# Altium schematic sheet Control.SchDoc: Control
size A; ApprovedBy: Emmanuel Plascencia; CheckedBy: Emmanuel Plascencia; DocumentNumber: 2; SheetNumber: 3; SheetTotal: 3; Size: A
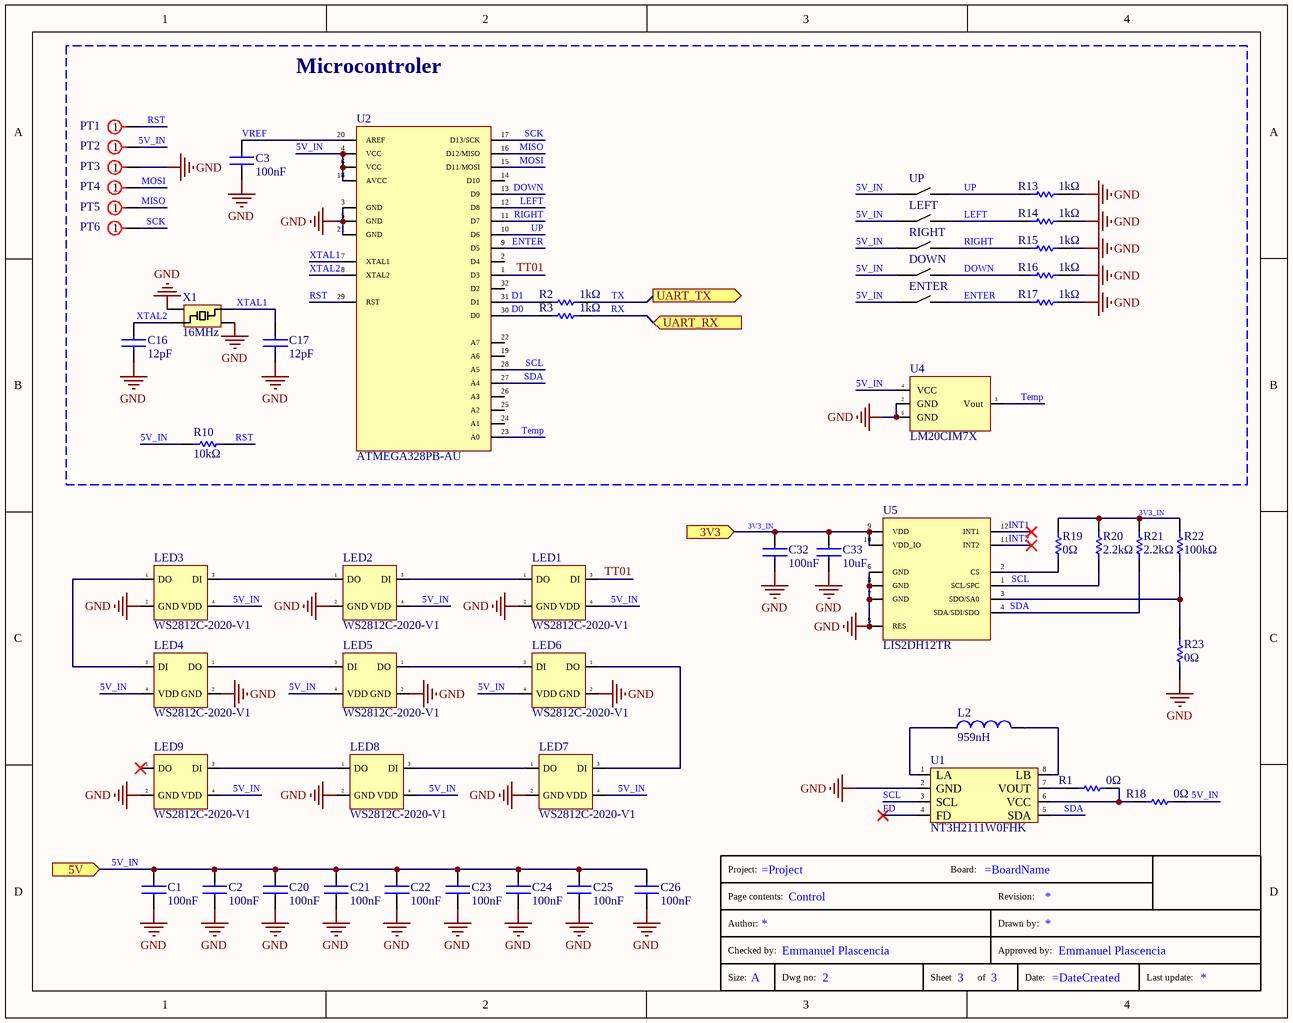
[diagram p0: Control.SchDoc]

## Parts
C1  100nF  [CAP0201_0.65_0.35]
C2  100nF  [CAP0201_0.65_0.35]
C3  100nF  [CAP0201_0.65_0.35]
C16  12pF  [CAP0402]
C17  12pF  [CAP0402]
C20  100nF  [CAP0201_0.65_0.35]
C21  100nF  [CAP0201_0.65_0.35]
C22  100nF  [CAP0201_0.65_0.35]
C23  100nF  [CAP0201_0.65_0.35]
C24  100nF  [CAP0201_0.65_0.35]
C25  100nF  [CAP0201_0.65_0.35]
C26  100nF  [CAP0201_0.65_0.35]
C32  100nF  [CAP0201_0.65_0.35]
C33  10uF  [CAP0402]
DOWN  TS3735PA 300gf 030  [TS3735PA 300gf 030]  (value not drawn)
ENTER  TS3735PA 300gf 030  [TS3735PA 300gf 030]  (value not drawn)
L2  959nH  [Antenne]
LED1  WS2812C-2020-V1  [WS2812C-2020]
LED2  WS2812C-2020-V1  [WS2812C-2020]
LED3  WS2812C-2020-V1  [WS2812C-2020]
LED4  WS2812C-2020-V1  [WS2812C-2020]
LED5  WS2812C-2020-V1  [WS2812C-2020]
LED6  WS2812C-2020-V1  [WS2812C-2020]
LED7  WS2812C-2020-V1  [WS2812C-2020]
LED8  WS2812C-2020-V1  [WS2812C-2020]
LED9  WS2812C-2020-V1  [WS2812C-2020]
LEFT  TS3735PA 300gf 030  [TS3735PA 300gf 030]  (value not drawn)
PT1  1x Test_point_for_beds_of_nails  [POINT-TEST (Pad 1mm no hole)]  (value not drawn)  (no BOM)
PT2  1x Test_point_for_beds_of_nails  [POINT-TEST (Pad 1mm no hole)]  (value not drawn)  (no BOM)
PT3  1x Test_point_for_beds_of_nails  [POINT-TEST (Pad 1mm no hole)]  (value not drawn)  (no BOM)
PT4  1x Test_point_for_beds_of_nails  [POINT-TEST (Pad 1mm no hole)]  (value not drawn)  (no BOM)
PT5  1x Test_point_for_beds_of_nails  [POINT-TEST (Pad 1mm no hole)]  (value not drawn)  (no BOM)
PT6  1x Test_point_for_beds_of_nails  [POINT-TEST (Pad 1mm no hole)]  (value not drawn)  (no BOM)
R1  0Ω  [RES0402]
R2  1kΩ  [RES0402]
R3  1kΩ  [RES0402]
R10  10kΩ  [RES0402]
R13  1kΩ  [RES0402]
R14  1kΩ  [RES0402]
R15  1kΩ  [RES0402]
R16  1kΩ  [RES0402]
R17  1kΩ  [RES0402]
R18  0Ω  [RES0402]
R19  0Ω  [RES0402]
R20  2.2kΩ  [RES0402]
R21  2.2kΩ  [RES0402]
R22  100kΩ  [RES0402]
R23  0Ω  [RES0402]
RIGHT  TS3735PA 300gf 030  [TS3735PA 300gf 030]  (value not drawn)
U1  NT3H2111W0FHK  [QFN8P50_160X160X50L40X20N]
U2  ATMEGA328PB-AU  [TQFP80P900X900X120-32N]
U4  LM20CIM7X  [SOT65P210X110-5N]
U5  LIS2DH12TR  [SON50P200X100-8N]
U?  Title Block  (value not drawn)  (graphical)
UP  TS3735PA 300gf 030  [TS3735PA 300gf 030]  (value not drawn)
X1  16MHz  [CRYSTAL_3.2mmX2.5mm_2]

## Blocks framed on the sheet
Microcontroler: C3 C16 C17 DOWN ENTER LEFT PT1-PT6 R2 R3 R10 R13-R17 RIGHT U2 U4 UP X1

## Ports
3V3 (in), 5V (in), UART_RX (in), UART_TX (out)

## Nets
GND: C1.2 C2.2 C3.2 C16.2 C17.2 C20.2 C21.2 C22.2 C23.2 C24.2 C25.2 C26.2 C32.2 C33.2 LED1.2(GND) LED2.2(GND) LED3.2(GND) LED4.2(GND) LED5.2(GND) LED6.2(GND) LED7.2(GND) LED8.2(GND) LED9.2(GND) PT3.1 R13.1 R14.1 R15.1 R16.1 R17.1 R23.1 U1.2(GND) U2.3(GND) U2.5(GND) U2.21(GND) U4.2(GND) U4.5(GND) U5.5(RES) U5.6(GND) U5.7(GND) U5.8(GND) X1.2 X1.4
3V3_IN: C32.1 C33.1 R19.1 R20.1 R21.1 R22.1 U5.9(VDD) U5.10(VDD_IO) ; port 3V3
5V_IN: C1.1 C2.1 C20.1 C21.1 C22.1 C23.1 C24.1 C25.1 C26.1 DOWN.1(A1) ENTER.1(A1) LED1.4(VDD) LED2.4(VDD) LED3.4(VDD) LED4.4(VDD) LED5.4(VDD) LED6.4(VDD) LED7.4(VDD) LED8.4(VDD) LED9.4(VDD) LEFT.1(A1) PT2.1 R10.1 R18.2 RIGHT.1(A1) U2.4(VCC) U2.6(VCC) U2.18(AVCC) U4.4(VCC) UP.1(A1) ; port 5V
D0: R3.1 U2.30(D0)
D1: R2.1 U2.31(D1)
DOWN: DOWN.2(A2) R16.2 U2.13(D9)
ENTER: ENTER.2(A2) R17.2 U2.9(D5)
FD: U1.4(FD)
INT1: U5.12(INT1)
INT2: U5.11(INT2)
LEFT: LEFT.2(A2) R14.2 U2.12(D8)
MISO: PT5.1 U2.16(D12/MISO)
MOSI: PT4.1 U2.15(D11/MOSI)
RIGHT: R15.2 RIGHT.2(A2) U2.11(D7)
RST: PT1.1 R10.2 U2.29(RST)
RX: R3.2 ; port UART_RX
SCK: PT6.1 U2.17(D13/SCK)
SCL: R20.2 U1.3(SCL) U2.28(A5) U5.1(SCL/SPC)
SDA: R21.2 U1.5(SDA) U2.27(A4) U5.4(SDA/SDI/SDO)
Temp: U2.23(A0) U4.3(Vout)
TT01: LED1.3(DI) U2.1(D3)
TX: R2.2 ; port UART_TX
UP: R13.2 U2.10(D6) UP.2(A2)
VREF: C3.1 U2.20(AREF)
XTAL1: C17.1 U2.7(XTAL1) X1.3
XTAL2: C16.1 U2.8(XTAL2) X1.1
NetL2_1: L2.1 U1.1(LA)
NetL2_2: L2.2 U1.8(LB)
NetLED1_1: LED1.1(DO) LED2.3(DI)
NetLED2_1: LED2.1(DO) LED3.3(DI)
NetLED3_1: LED3.1(DO) LED4.3(DI)
NetLED4_1: LED4.1(DO) LED5.3(DI)
NetLED5_1: LED5.1(DO) LED6.3(DI)
NetLED6_1: LED6.1(DO) LED7.3(DI)
NetLED7_1: LED7.1(DO) LED8.3(DI)
NetLED8_1: LED8.1(DO) LED9.3(DI)
NetR1_1: R1.1 U1.7(VOUT)
NetR1_2: R1.2 R18.1 U1.6(VCC)
NetR19_2: R19.2 U5.2(CS)
NetR22_2: R22.2 R23.2 U5.3(SDO/SA0)

Not connected (* = marked no-connect by the designer): LED9 1(DO)*; U2 2(D4) 14(D10) 19(A6) 22(A7) 24(A1) 25(A2) 26(A3) 32(D2)

## Notes on the sheet
- (in symbol Title Blok OLEDCOMM) Project:; Board:; Page contents:; Revision:; Author:; Drawn by:; Checked by:; Approved by:; Size:; Dwg no:; Sheet; of; Date:; Last update:

## Library data of the parts
C1-C3 C20-C26 C32 = C0201_100nF_10V_X5R: Capacitor ceramic MLCC - SMD 0201 100nF, 10V, X5R, 10%; Ref Fabricant: GRM033R61A104KE15D; Ref Fournisseur: C76934; Fournisseur: LCSC; Fabricant: Murata Electronics; Unit Price(100): 0.002; Unit Price(10000): 0.0015; Help URL: https://lcsc.com/product-detail/Multilayer-Ceramic-Capacitors-MLCC-SMD-SMT_Murata-Electronics-GRM033R61A104KE15D_C76934.html; Unit Price: 0.002; Unit Price(10): 0.002
C16 C17 = C0402_12pF_50V_C0G (NP0): Capacitor ceramic MLCC - SMD 0402 12pF, 50V, C0G (NP0), 20%; Ref Fabricant: CC0402JRNPO9BN120; Ref Fournisseur: C106201; Fournisseur: LCSC; Fabricant: Yageo; Unit Price(100): 0.0013; Unit Price(1000): 0.001; Unit Price(10000): 0.0009; Unit Price(100000): 0.0008; Help URL: https://www.mouser.fr/ProductDetail/YAGEO/CC0402JRNPO9BN120?qs=%2Fha2pyFadugad28DmURO4f8iWSv%252BQnq1zQRrAWNTY3HHadEPskU8GA%3D%3D; Unit Price: 0.0013; Unit Price(10): 0.0013
C33 = C0402_10uF_10V_X5R: Capacitor ceramic MLCC - SMD 0402 10uF, 10V, X5R, 20%; Ref Fabricant: CL05A106MP5NUNC; Ref Fournisseur: C315248; Fournisseur: LCSC; Fabricant: Samsung Electro-Mechanics; Unit Price(100): 0.011; Unit Price(1000): 0.009; Unit Price(1500): 0.0079; Unit Price(10000): 0.0065; Unit Price(20000): 0.006; Unit Price(50000): 0.0057; Help URL: https://datasheet.lcsc.com/lcsc/2007131004_Samsung-Electro-Mechanics-CL05A106MP5NUNC_C315248.pdf; Unit Price: 0.011; Unit Price(10): 0.011; Unit Price(50): 0.011; Unit Price(500): 0.009
DOWN ENTER LEFT RIGHT UP = TS3735PA 300gf 030: Tactile Switch SPST 300gf Surface Mount; Fournisseur: LCSC; Ref Fournisseur: C5363478; Fabricant: SHOU HAN; Unit Price(50): 0.0188; Unit Price(500): 0.0147; Unit Price(1500): 0.0125; Ref Fabricant: TS3735PA 300gf 030; Help URL: https://www.lcsc.com/datasheet/C5363478.pdf?spm=wm.sxq.inf.ggs___wm.fly.bg.6.xh&lcsc_vid=FgJXV1VSRgJaVwUHEgQNVVQEQlFXBl0FFVhdUwYFRgUxVlNRQVFXUV1QRVlXXjsOAxUeFF5JWBYZEEoKFBINSQcJGk4NBhADEA4cHktQQ1NADxALGw%3D%3D; Unit Price: 0.0188
L2 = Antenne: 959nH 1.6pF 1.36ohm 128MHz
LED1-LED9 = WS2812C-2020-V1: Intelligent external control integrated LED - CMS RGB, 2020; Ref Fournisseur: C2976072; Fournisseur: LCSC; Fabricant: Worldsemi; Unit Price(10): 0.0893; Unit Price(100): 0.0736; Unit Price(1000): 0.0599; Unit Price(150): 0.0658; Unit Price(2500): 0.0484; Unit Price(4500): 0.046; Ref Fabricant: WS2812C-2020-V1; Help URL: https://datasheet.lcsc.com/lcsc/2202221130_Worldsemi-WS2812C-2020-V1_C2976072.pdf; Unit Price: 0.0893; Unit Price(5): 0.0893; Unit Price(50): 0.0736; Unit Price(500): 0.0599
PT1-PT6 = 1x_Test_point_for_beds_of_nails: Fabricant: PCB Footprint; Ref Fabricant: PCB Footprint; Fournisseur: PCB Footprint; Ref Fournisseur: PCB Footprint; Help URL: PCB Footprint
R1 R18 R19 R23 = R0402_0R_50V_Thick: Resistor Thick Film SMD 0402, 0Ω, 50V, 1/16W, 1%; Ref Fabricant: RC0402FR-070RL; Ref Fournisseur: C106231; Fournisseur: LCSC; Fabricant: YAGEO; Unit Price(100): 0.0006; Unit Price(1000): 0.0004; Help URL: https://datasheet.lcsc.com/lcsc/1809291220_YAGEO-RC0402FR-070RL_C106231.pdf; Unit Price: 0.0006; Unit Price(10): 0.0006
R2 R3 R13-R17 = R0402_1k_50V_Thick: Resistor Thick Film SMD 0402, 1kΩ, 50V, 1/16W, 1%; Ref Fabricant: RC0402FR-071KL; Ref Fournisseur: C106235; Fournisseur: LCSC; Fabricant: YAGEO; Unit Price(100): 0.0007; Unit Price(1000): 0.0006; Unit Price(10000): 0.0005; Help URL: https://datasheet.lcsc.com/lcsc/1809301716_YAGEO-RC0402FR-071KL_C106235.pdf; Unit Price: 0.0007; Unit Price(10): 0.0007
R10 = R0402_10k_50V_Thick: Resistor Thick Film SMD 0402, 10kΩ, 50V, 1/16W, 1%; Ref Fabricant: RC0402FR-0710KL; Ref Fournisseur: C60490; Fournisseur: LCSC; Fabricant: YAGEO; Unit Price(100): 0.0007; Unit Price(1000): 0.0005; Unit Price(50000): 0.0004; Help URL: https://datasheet.lcsc.com/lcsc/1809301715_YAGEO-RC0402FR-0710KL_C60490.pdf; Unit Price: 0.0007; Unit Price(10): 0.0007
R20 R21 = R0402_2.2k_50V_Thick: Resistor Thick Film SMD 0402, 2.2kΩ, 50V, 1/16W, 1%; Ref Fabricant: RC0402FR-072K2L; Ref Fournisseur: 603-RC0402FR-072K2L; Fournisseur: Mouser; Fabricant: Yageo; Unit Price(100): 0.003; Unit Price(10): 0.01; Help URL: https://www.mouser.fr/datasheet/2/447/PYu-RC_Group_51_RoHS_L_10-1527934.pdf; Unit Price: 0.087; Unit Price(1000): 0.003
R22 = R0402_100k_50V_Thick_1: Resistor Thick Film SMD 0402, 100kΩ, 50V, 63mW, 1%; Ref Fabricant: AECR0402F100KK9; Ref Fournisseur: C328296; Fournisseur: LCSC; Fabricant: Resistor.Today; Unit Price(100): 0.0022; Unit Price(1000): 0.0018; Unit Price(3000): 0.0015; Unit Price(10000): 0.0012; Unit Price(100000): 0.0011; Help URL: https://datasheet.lcsc.com/lcsc/1811091031_Resistor-Today-AECR0402F100KK9_C328296.pdf; Unit Price: 0.0022; Unit Price(10): 0.0022
U1 = NT3H2111W0FHK: NTAG I²C plus: NFC Forum T2T with I²C interface, password protection and energy harvesting; Fournisseur: LCSC; Ref Fournisseur: C710403; Fabricant: Nexperia; Unit Price(50): 0.634; Unit Price(150): 0.5663; Unit Price(500): 0.4985; Ref Fabricant: NT3H2111W0FHK; Help URL: https://www.lcsc.com/product-detail/C710403.html?s_z=n_NT3H2111W0FHK; Unit Price: 0.7711
U2 = ATMEGA328PB-AU: AVR Microcontroller with Core Independent Peripherals and PicoPower Technology; Fabricant: MICROCHIP; Fournisseur: LCSC; Ref Fournisseur: C132230; Unit Price(10): 1.5496; Unit Price(30): 1.3877; Unit Price(1000): 1.0721; Help URL: https://www.lcsc.com/datasheet/C132230.pdf?spm=wm.sxq.inf.ggs___wm.ssy.bg.0.xh&lcsc_vid=FgJXV1VSRgJaVwUHEgQNVVQEQlFXBl0FFVhdUwYFRgUxVlNRQVFWV1VXQ1hYVjsOAxUeFF5JWBYZEEoKFBINSQcJGk4%3D; Ref Fabricant: ATMEGA328PB-AU; Unit Price: 1.8076
U4 = LM20CIM7X: SC-70-5 Thermostats - Solid State RoHS; Fabricant: Texas Instruments; Fournisseur: LCSC; Ref Fabricant: LM20CIM7X/NOPB; Ref Fournisseur: C2863108; Unit Price(100): 0.3651; Unit Price(10): 0.5005; Unit Price(1000): 0.3109; Help URL: https://www.lcsc.com/datasheet/C2863108.pdf; Unit Price: 0.6424
U5 = LIS2DH12TR: MEMS digital output motion sensor: ultra-low-power high-performance 3-axis "femto" accelerometer; Fabricant: ST; Fournisseur: LCSC; Ref Fournisseur: C110926; Unit Price(100): 0.5049; Unit Price(10): 0.6796; Unit Price(1000): 0.4649; Ref Fabricant: LIS2DH12TR; Help URL: https://www.lcsc.com/datasheet/C110926.pdf; Unit Price: 0.8143
U? = Title Blok OLEDCOMM
X1 = SX3B16.000F1210F30: Crystal 16MHz ±10ppm 12pF 60Ω SMD3225-4P; Fabricant: SCTF; Fournisseur: LCSC; Ref Fournisseur: C2901669; Unit Price(150): 0.0454; Unit Price(50): 0.0485; Unit Price(500): 0.0431; Help URL: https://www.lcsc.com/datasheet/C2901669.pdf?spm=wm.sxq.inf.ggs___wm.fly.bg.8.xh&lcsc_vid=FgJXV1VSRgJaVwUHEgQNVVQEQlFXBl0FFVhdUwYFRgUxVlNRQVFWVFxeQVlXXjsOAxUeFF5JWBYZEEoKFBINSQcJGk4dAgUUFAk%3D; Ref Fabricant: SX3B16.000F1210F30; Unit Price: 0.0547